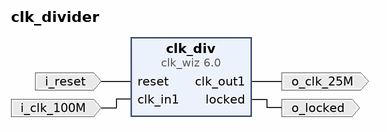
[diagram p0: block diagram of the top level]
# Vivado block design clk_divider, xc7a35ticsg324-1L, Vivado 2020.2
create_bd_design clk_divider

create_bd_port -dir I -type rst i_reset
set_property -dict {CONFIG.POLARITY ACTIVE_HIGH} [get_bd_ports i_reset]
create_bd_port -dir I -type clk i_clk_100M
set_property -dict {CONFIG.FREQ_HZ 100000000} [get_bd_ports i_clk_100M]
create_bd_port -dir O o_locked
create_bd_port -dir O -type clk o_clk_25M

create_bd_cell -type ip -vlnv xilinx.com:ip:clk_wiz:6.0 clk_div
set_property -dict [list \
  CONFIG.CLKOUT1_JITTER 319.783 \
  CONFIG.CLKOUT1_PHASE_ERROR 246.739 \
  CONFIG.CLKOUT1_REQUESTED_OUT_FREQ 25.175 \
  CONFIG.CLK_OUT1_PORT clk_out1 \
  CONFIG.MMCM_CLKFBOUT_MULT_F 36.375 \
  CONFIG.MMCM_CLKOUT0_DIVIDE_F 36.125 \
  CONFIG.MMCM_DIVCLK_DIVIDE 4 \
] [get_bd_cells clk_div]

# ---- connections ----

connect_bd_net [get_bd_ports i_reset] [get_bd_pins clk_div/reset]
connect_bd_net [get_bd_ports i_clk_100M] [get_bd_pins clk_div/clk_in1]
connect_bd_net [get_bd_pins clk_div/locked] [get_bd_ports o_locked]
connect_bd_net -net o_clk_25M [get_bd_pins clk_div/clk_out1] [get_bd_ports o_clk_25M]

validate_bd_design
save_bd_design
